# Altium schematic sheet Sheet_DC.SchDoc
size A4
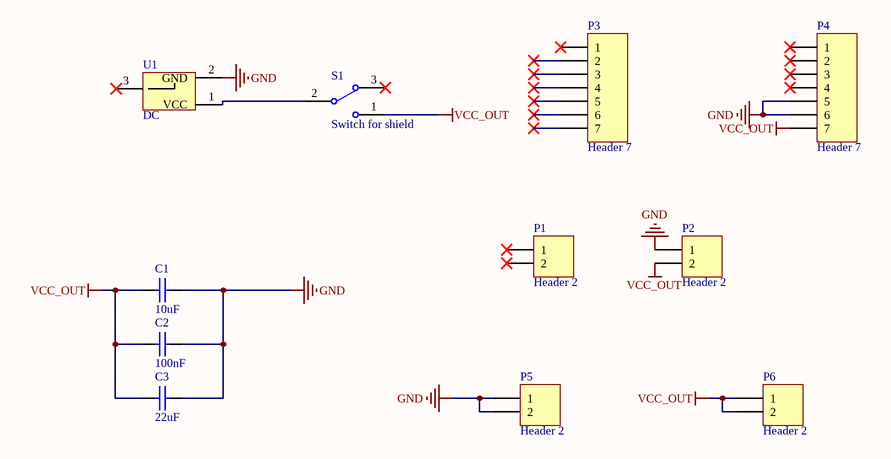
[diagram p0: Sheet_DC.SchDoc]

## Parts
C1  10uF  [C0603]
C2  100nF  [C0603]
C3  22uF  [C0603]
P1  Header 2  [HDR1X2]
P2  Header 2  [HDR1X2]
P3  Header 7  [HDR1X7]
P4  Header 7  [HDR1X7]
P5  Header 2  [HDR1X2]
P6  Header 2  [HDR1X2]
S1  Switch for shield  [Switch_battery]
U1  DC  [DC]

## Nets
GND: C1.2 C2.2 C3.2 P2.1 P4.5 P4.6 P5.1 P5.2 U1.2(GND)
VCC_OUT: C1.1 C2.1 C3.1 P2.2 P4.7 P6.1 P6.2 S1.1
NetS1_2: S1.2 U1.1(VCC)

Not connected (* = marked no-connect by the designer): P1 1* 2*; P3 1* 2* 3* 4* 5* 6* 7*; P4 1* 2* 3* 4*; S1 3*; U1 3(Bat)*

## Library data of the parts
C1-C3 = C0603: 贴片电容
P1 P2 P5 P6 = Header 2: Header, 2-Pin; LatestRevisionDate: 17-Jul-2002; LatestRevisionNote: Re-released for DXP Platform.; Publisher: Altium Limited
P3 P4 = Header 7: Header, 7-Pin; LatestRevisionDate: 17-Jul-2002; LatestRevisionNote: Re-released for DXP Platform.; Publisher: Altium Limited
S1 = Switch_battery: 三脚开关
U1 = DC: DC插座